# EAGLE design TSOC_Block_Template_Dual_SS_SMD (EAGLE 6.6.0)
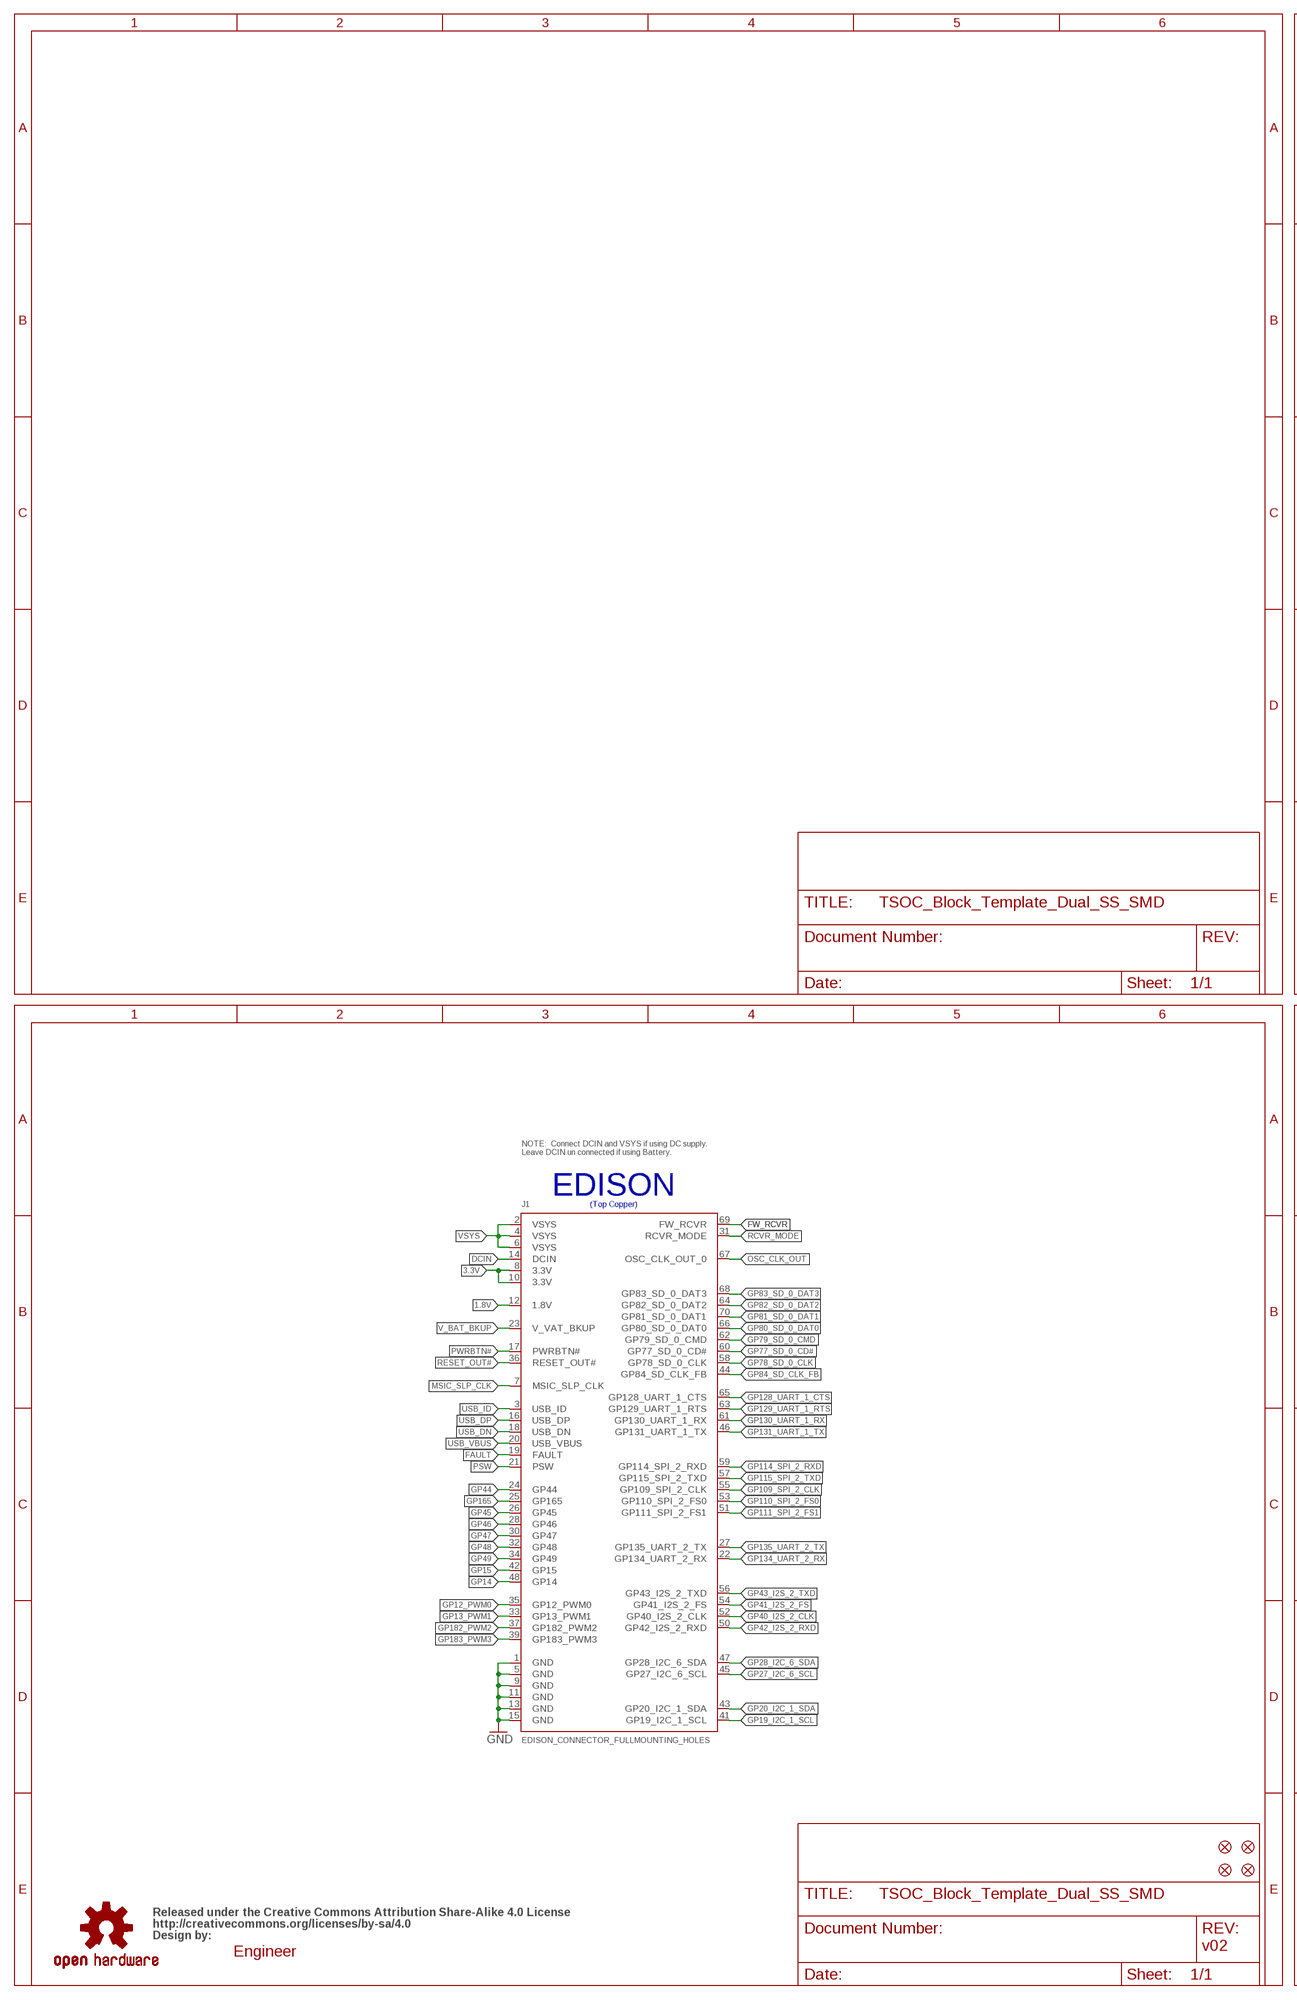
[diagram p0: schematic, sheet 1, part 1 of 2]
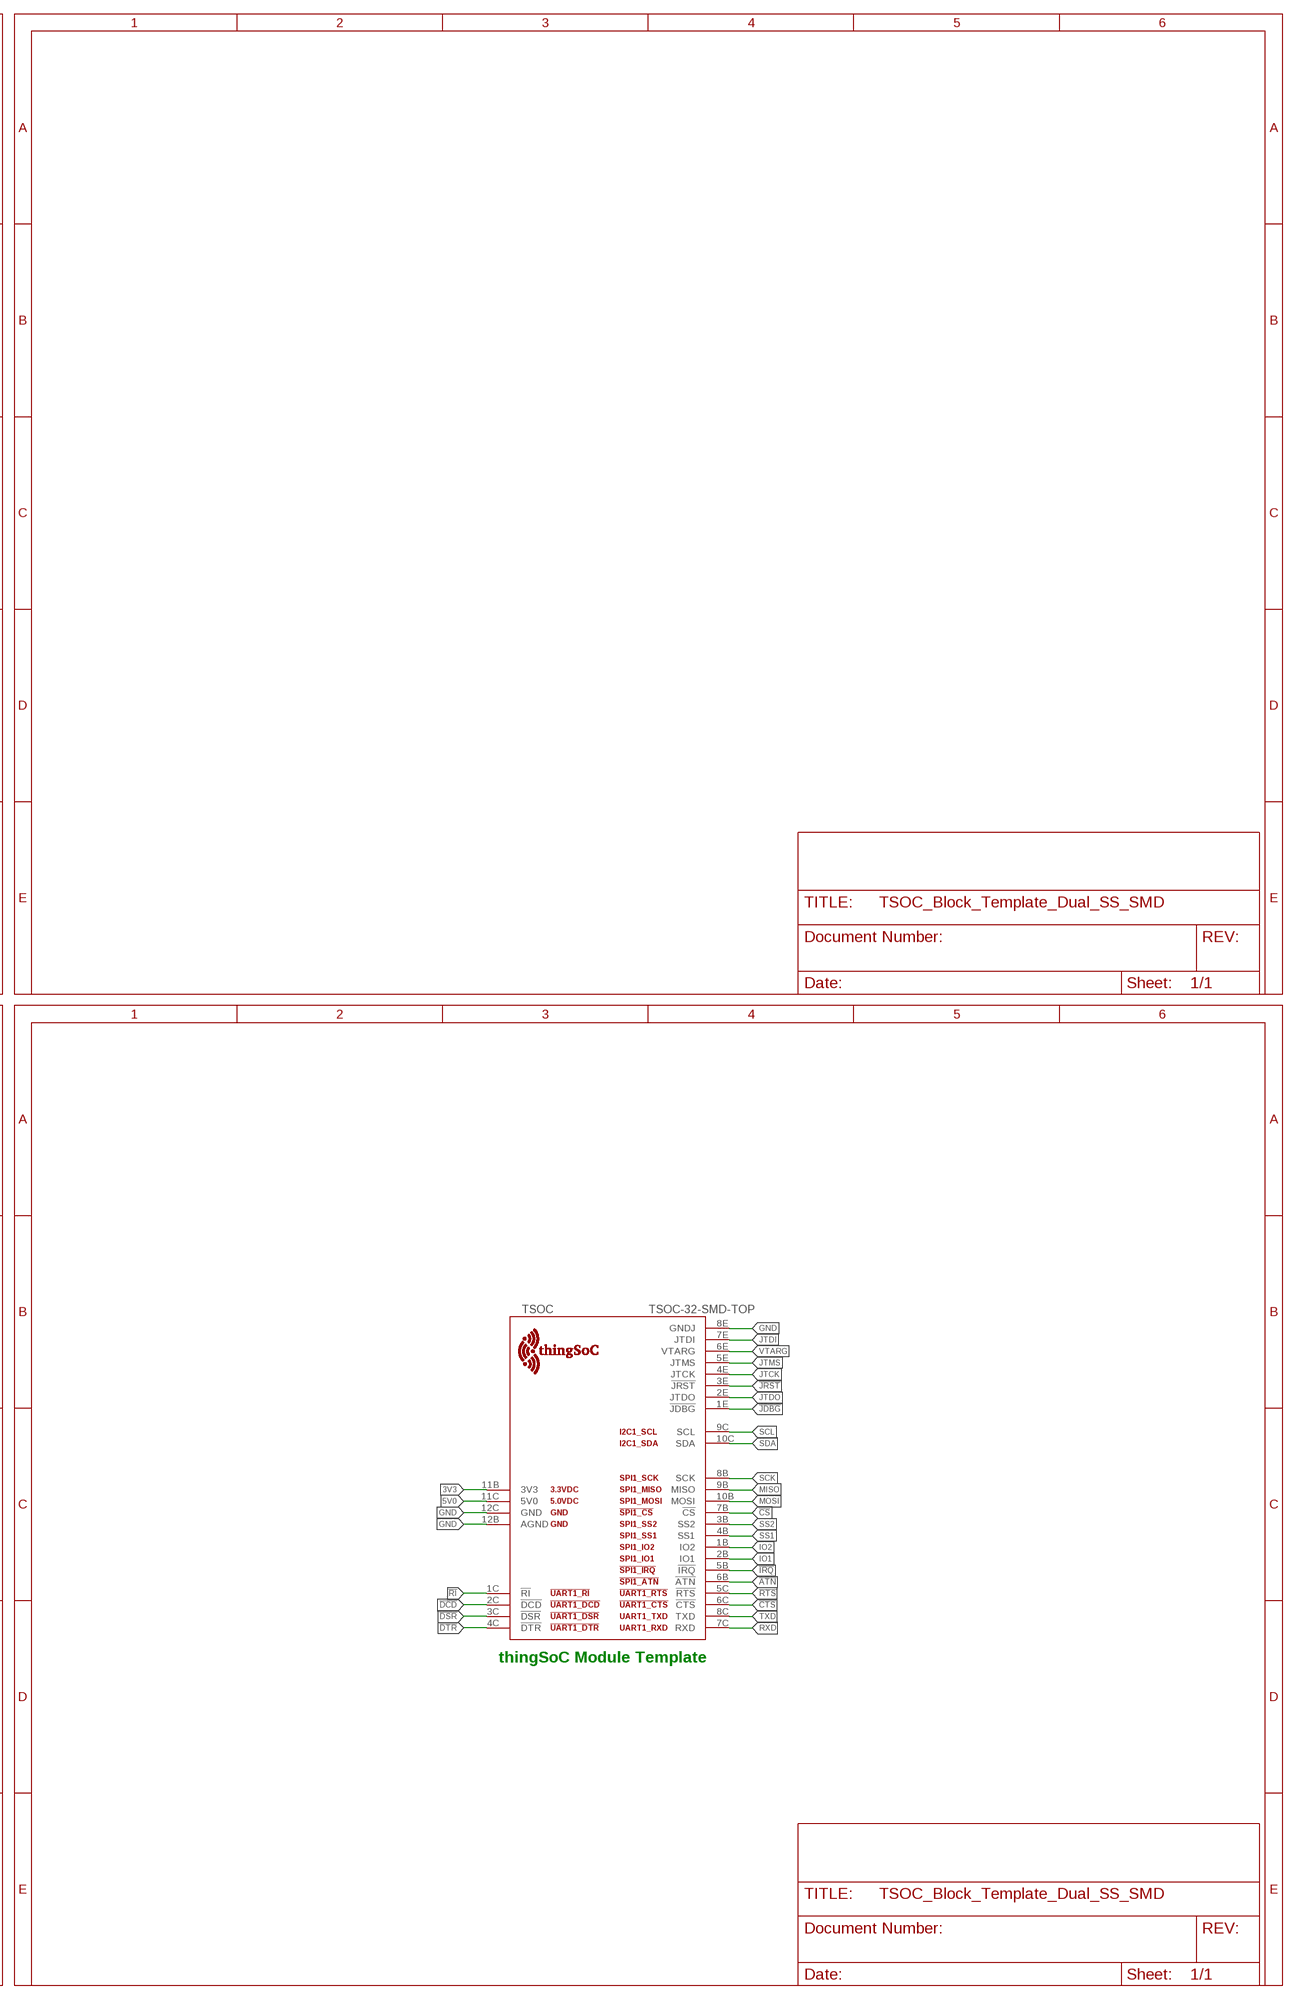
[diagram p1: schematic, sheet 1, part 2 of 2]

## Parts
FID5  FIDUCIAL1X2  [FIDUCIAL-1X2]
FID6  FIDUCIAL1X2  [FIDUCIAL-1X2]
FID7  FIDUCIAL1X2  [FIDUCIAL-1X2]
FID8  FIDUCIAL1X2  [FIDUCIAL-1X2]
J1  EDISON_CONNECTOR_FULLMOUNTING_HOLES  [EDISON_DAUGHTER]
LOGO5  OSHW-LOGOS  [OSHW-LOGO-S]
TSOC  TSOC-32-SMD-TOP  [TSOC-BB-S32-SMD-TOP]
U$1  BY_CC_SA_TEXTTEXT  [BY_CC_SA_TEXT]

## Nets
1.8V: J1.12(1.8V)
3.3V: J1.8(3.3V) J1.10(3.3V)
3V3: TSOC.11B(3V3)
5V0: TSOC.11C(5V0)
!ATN: TSOC.6B(!ATN)
!CS: TSOC.7B(!CS)
!CTS: TSOC.6C(!CTS)
!DCD: TSOC.2C(!DCD)
!DSR: TSOC.3C(!DSR)
!DTR: TSOC.4C(!DTR)
!IRQ: TSOC.5B(!IRQ)
!JDBG: TSOC.1E(!JDBG)
!JRST: TSOC.3E(!JRST)
!RI: TSOC.1C(!RI)
!RTS: TSOC.5C(!RTS)
DCIN: J1.14(DCIN)
FAULT: J1.19(FAULT)
FW_RCVR: J1.69(FW_RCVR)
GND: J1.1(GND) J1.5(GND) J1.9(GND) J1.11(GND) J1.13(GND) J1.15(GND) TSOC.8E(GNDJ) TSOC.12B(AGND) TSOC.12C(GND)
GP12_PWM0: J1.35(GP12_PWM0)
GP13_PWM1: J1.33(GP13_PWM1)
GP14: J1.48(GP14)
GP15: J1.42(GP15)
GP19_I2C_1_SCL: J1.41(GP19_I2C_1_SCL)
GP20_I2C_1_SDA: J1.43(GP20_I2C_1_SDA)
GP27_I2C_6_SCL: J1.45(GP27_I2C_6_SCL)
GP28_I2C_6_SDA: J1.47(GP28_I2C_6_SDA)
GP40_I2S_2_CLK: J1.52(GP40_I2S_2_CLK)
GP41_I2S_2_FS: J1.54(GP41_I2S_2_FS)
GP42_I2S_2_RXD: J1.50(GP42_I2S_2_RXD)
GP43_I2S_2_TXD: J1.56(GP43_I2S_2_TXD)
GP44: J1.24(GP44)
GP45: J1.26(GP45)
GP46: J1.28(GP46)
GP47: J1.30(GP47)
GP48: J1.32(GP48)
GP49: J1.34(GP49)
GP77_SD_0_CD#: J1.60(GP77_SD_0_CD#)
GP78_SD_0_CLK: J1.58(GP78_SD_0_CLK)
GP79_SD_0_CMD: J1.62(GP79_SD_0_CMD)
GP80_SD_0_DAT0: J1.66(GP80_SD_0_DAT0)
GP81_SD_0_DAT1: J1.70(GP81_SD_0_DAT1)
GP82_SD_0_DAT2: J1.64(GP82_SD_0_DAT2)
GP83_SD_0_DAT3: J1.68(GP83_SD_0_DAT3)
GP84_SD_CLK_FB: J1.44(GP84_SD_CLK_FB)
GP109_SPI_2_CLK: J1.55(GP109_SPI_2_CLK)
GP110_SPI_2_FS0: J1.53(GP110_SPI_2_FS0)
GP111_SPI_2_FS1: J1.51(GP111_SPI_2_FS1)
GP114_SPI_2_RXD: J1.59(GP114_SPI_2_RXD)
GP115_SPI_2_TXD: J1.57(GP115_SPI_2_TXD)
GP128_UART_1_CTS: J1.65(GP128_UART_1_CTS)
GP129_UART_1_RTS: J1.63(GP129_UART_1_RTS)
GP130_UART_1_RX: J1.61(GP130_UART_1_RX)
GP131_UART_1_TX: J1.46(GP131_UART_1_TX)
GP134_UART_2_RX: J1.22(GP134_UART_2_RX)
GP135_UART_2_TX: J1.27(GP135_UART_2_TX)
GP165: J1.25(GP165)
GP182_PWM2: J1.37(GP182_PWM2)
GP183_PWM3: J1.39(GP183_PWM3)
IO1: TSOC.2B(IO1)
IO2: TSOC.1B(IO2)
JTCK: TSOC.4E(JTCK)
JTDI: TSOC.7E(JTDI)
JTDO: TSOC.2E(JTDO)
JTMS: TSOC.5E(JTMS)
MISO: TSOC.9B(MISO)
MOSI: TSOC.10B(MOSI)
MSIC_SLP_CLK: J1.7(MSIC_SLP_CLK)
OSC_CLK_OUT: J1.67(OSC_CLK_OUT_0)
PSW: J1.21(PSW)
PWRBTN#: J1.17(PWRBTN#)
RCVR_MODE: J1.31(RCVR_MODE)
RESET_OUT#: J1.36(RESET_OUT#)
RXD: TSOC.7C(RXD)
SCK: TSOC.8B(SCK)
SCL: TSOC.9C(SCL)
SDA: TSOC.10C(SDA)
SS1: TSOC.4B(SS1)
SS2: TSOC.3B(SS2)
TXD: TSOC.8C(TXD)
USB_DN: J1.18(USB_DN)
USB_DP: J1.16(USB_DP)
USB_ID: J1.3(USB_ID)
USB_VBUS: J1.20(USB_VBUS)
V_BAT_BKUP: J1.23(V_VAT_BKUP)
VSYS: J1.2(VSYS) J1.4(VSYS) J1.6(VSYS)
VTARG: TSOC.6E(VTARG)

## Notes on the sheet
- NOTE:  Connect DCIN and VSYS if using DC supply.
  Leave DCIN un connected if using Battery.
- EDISON
- (Top Copper)
- thingSoC Module Template
- Engineer
- v02

## Library data of the parts
FID5-FID8 = SparkFun-Aesthetics:FIDUCIAL: Fiducial Alignment Points Various fiducial points for machine vision alignment.
J1 = Edison:EDISON_CONNECTOR_FULL
LOGO5 = SparkFun-Aesthetics:OSHW-LOGO: Open Source Hardware Logo This logo indicates the piece of hardware it is found on incorporates a OSHW license and/or adheres to the definition of open source hardware found here: http://freedomdefined.org/OSHW
TSOC = thingSoC:TSOC-32: thingSoC Thirty-Two (32) Pin Socket Source LBR : http://www.thingsoc.com Github : https://github.com/thingsoc License : http://creativecommons.org/licenses/by-sa/4.0/ (Creative Commons 4.0) THIS SOFTWARE IS PROVIDED BY THE CONTRIBUTORS "AS IS" AND WITHOUT ANY EXPRESS OR IMPLIED WARRANTIES, INCLUDING, BUT NOT LIMITED TO, THE IMPLIED WARRANTIES OF MERCHANTABILITY AND FITNESS FOR A PARTICULAR PURPOSE ARE DISCLAIMED. IN NO EVENT SHALL THE COPYRIGHT OWNER OR CONTRIBUTORS BE LIABLE FOR ANY DIRECT, INDIRECT, INCIDENTAL, SPECIAL, EXEMPLARY, OR CONSEQUENTIAL DAMAGES (INCLUDING, BUT NOT LIMITED TO, PROCUREMENT OF SUBSTITUTE GOODS OR SERVICES; LOSS OF USE, DATA, OR PROFITS; OR BUSINESS INTERRUPTION) HOWEVER CAUSED AND ON ANY THEORY OF LIABILITY, WHETHER IN CONTRACT, STRICT LIABILITY, OR TORT (INCLUDING NEGLIGENCE OR OTHERWISE) ARISING IN ANY WAY OUT OF THE USE OF THIS SOFTWARE, EVEN IF ADVISED OF THE POSSIBILITY OF SUCH DAMAGE.
U$1 = PatternAgents-Logos:BY_CC_SA_TEXT: BY_CC_SA_TEXT Source : http://wiki.creativecommons.org/CC_markers Github : https://github.com/PatternAgents/PCB_Libraries License : http://creativecommons.org/licenses/by-sa/4.0/ (Creative Commons 4.0) THIS SOFTWARE IS PROVIDED BY THE CONTRIBUTORS "AS IS" AND WITHOUT ANY EXPRESS OR IMPLIED WARRANTIES, INCLUDING, BUT NOT LIMITED TO, THE IMPLIED WARRANTIES OF MERCHANTABILITY AND FITNESS FOR A PARTICULAR PURPOSE ARE DISCLAIMED. IN NO EVENT SHALL THE COPYRIGHT OWNER OR CONTRIBUTORS BE LIABLE FOR ANY DIRECT, INDIRECT, INCIDENTAL, SPECIAL, EXEMPLARY, OR CONSEQUENTIAL DAMAGES (INCLUDING, BUT NOT LIMITED TO, PROCUREMENT OF SUBSTITUTE GOODS OR SERVICES; LOSS OF USE, DATA, OR PROFITS; OR BUSINESS INTERRUPTION) HOWEVER CAUSED AND ON ANY THEORY OF LIABILITY, WHETHER IN CONTRACT, STRICT LIABILITY, OR TORT (INCLUDING NEGLIGENCE OR OTHERWISE) ARISING IN ANY WAY OUT OF THE USE OF THIS SOFTWARE, EVEN IF ADVISED OF THE POSSIBILITY OF SUCH DAMAGE.

## Net classes
1 vcc: width 0.254 mm

## Board
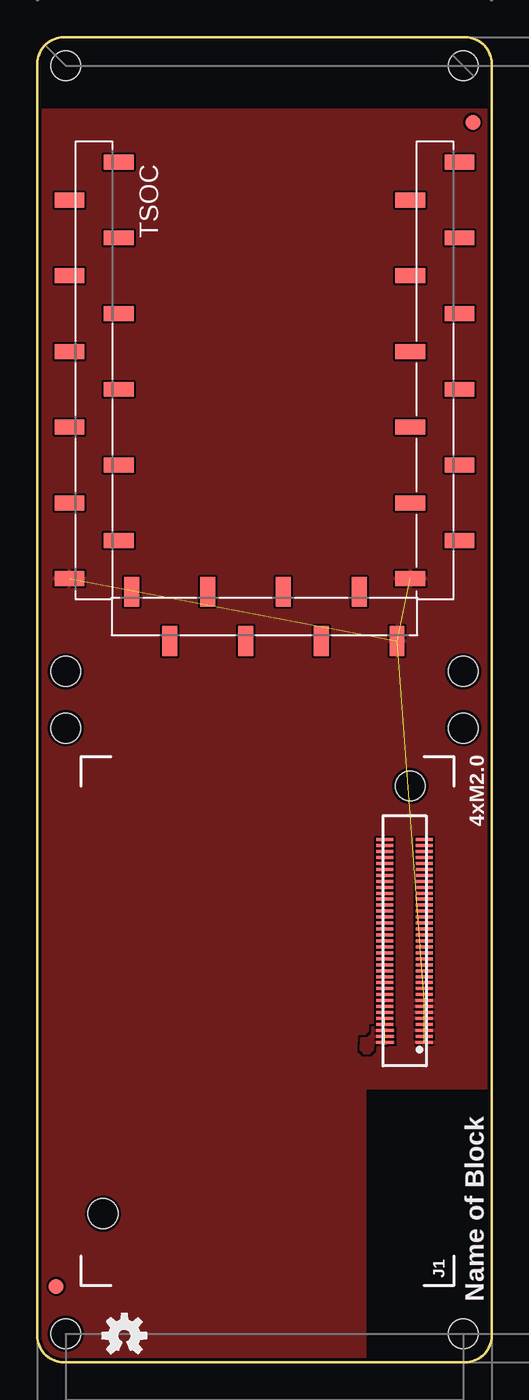
[diagram p2: board, top side]
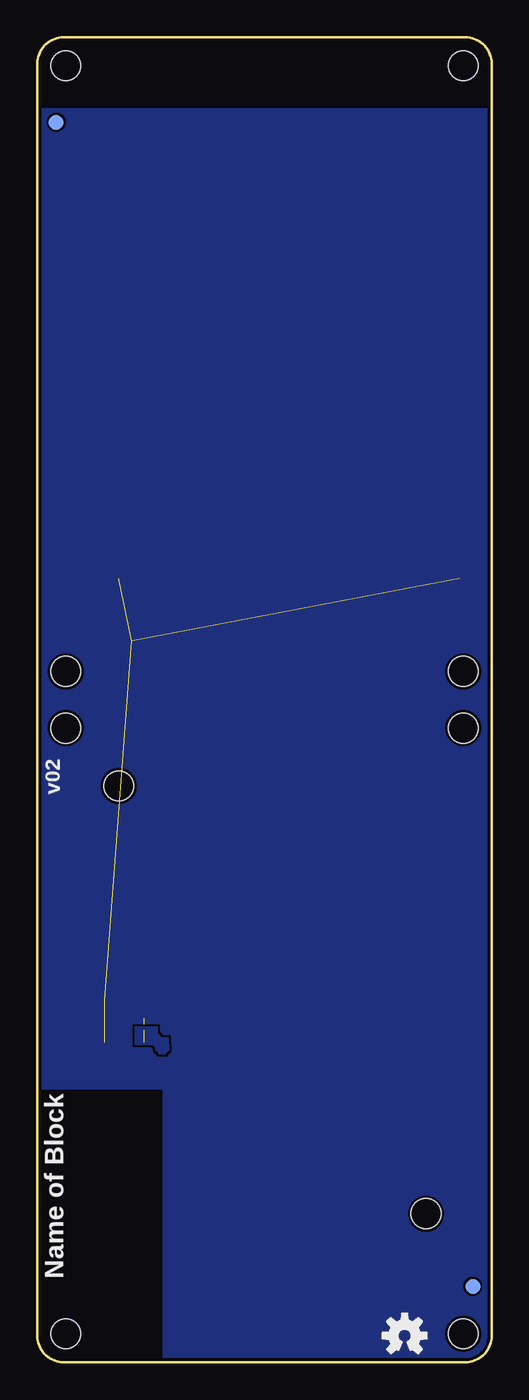
[diagram p3: board, bottom side, seen from below]

Size 30.48 x 88.9 mm. Coordinates in mm from the lower left corner, seen from the top.
Outline: 30.48,1.78 30.48,87.12 arc90 28.7,88.9 1.78,88.9 arc90 0,87.12 0,1.78 arc90 1.78,0 28.7,0 arc90 30.48,1.78
Copper layers (1*16): Top 0.035mm / dielectric 1.5mm / Bottom 0.035mm
Design rules "SparkFun-2-layer *": minimum track width 6mil, minimum drill 13mil, track to track 6mil, track to pad 6mil, pad to pad 6mil, via to via 6mil, smd to smd 6mil, copper to edge 8mil, drill to drill 8mil, minimum pad ring 12mil, minimum via ring 10mil, stop-mask expansion 4mil, vias tented up to drill 20mil, thermal gap 6mil
Holes 2 mm at 28.57,87 1.91,87 1.91,1.91 28.57,1.91 1.91,42.55 28.57,42.55 1.91,46.35 28.57,46.35
tRestrict: area 22.1,0 to 30.5,18.3; area 0,84.3 to 30.5,88.9
bRestrict: area 22.1,0 to 30.5,18.3; area 0,84.3 to 30.5,88.9

### Footprints (pad centres in the part's own frame; a part is rotated, then mirrored left to right if it is on the bottom)
FIDUCIAL-1X2 = smd 1 x 1: 1 0,0
EDISON_DAUGHTER = smd 1.14 x 0.2: 1 1.98,19.17; 2 4.62,19.17; 3 1.98,18.77; 4 4.62,18.77; 5 1.98,18.37; 6 4.62,18.37; 7 1.98,17.97; 8 4.62,17.97; 9 1.98,17.57; 10 4.62,17.57; 11 1.98,17.17; 12 4.62,17.17; 13 1.98,16.77; 14 4.62,16.77; 15 1.98,16.37; 16 4.62,16.37; 17 1.98,15.97; 18 4.62,15.97; 19 1.98,15.57; 20 4.62,15.57; 21 1.98,15.17; 22 4.62,15.17; 23 1.98,14.77; 24 4.62,14.77; 25 1.98,14.37; 26 4.62,14.37; 27 1.98,13.97; 28 4.62,13.97; 29 1.98,13.57; 30 4.62,13.57; 31 1.98,13.17; 32 4.62,13.17; 33 1.98,12.77; 34 4.62,12.77; 35 1.98,12.37; 36 4.62,12.37; 37 1.98,11.97; 38 4.62,11.97; 39 1.98,11.57; 40 4.62,11.57; 41 1.98,11.17; 42 4.62,11.17; 43 1.98,10.77; 44 4.62,10.77; 45 1.98,10.37; 46 4.62,10.37; 47 1.98,9.97; 48 4.62,9.97; 49 1.98,9.57; 50 4.62,9.57; 51 1.98,9.17; 52 4.62,9.17; 53 1.98,8.77; 54 4.62,8.77; 55 1.98,8.37; 56 4.62,8.37; 57 1.98,7.97; 58 4.62,7.97; 59 1.98,7.57; 60 4.62,7.57; 61 1.98,7.17; 62 4.62,7.17; 63 1.98,6.77; 64 4.62,6.77; 65 1.98,6.37; 66 4.62,6.37; 67 1.98,5.97; 68 4.62,5.97; 69 1.98,5.57; 70 4.62,5.57 | hole 2: 23.53,30.67; 2.93,1.98
TSOC-BB-S32-SMD-TOP = smd 1 x 2: 1B -11.43,-9.78; 1C -11.43,13.08; 2B -8.89,-13.08; 2C -8.89,9.78; 3B -6.35,-9.78; 3C -6.35,13.08; 4B -3.81,-13.08; 4C -3.81,9.78; 5B -1.27,-9.78; 5C -1.27,13.08; 6B 1.27,-13.08; 6C 1.27,9.78; 7B 3.81,-9.78; 7C 3.81,13.08; 8B 6.35,-13.08; 8C 6.35,9.78; 9B 8.89,-9.78; 9C 8.89,13.08; 10B 11.43,-13.08; 10C 11.43,9.78; 11B 13.97,-9.78; 11C 13.97,13.08; 12B 16.51,-13.08; 12C 16.51,9.78 | smd 2 x 1: 1E 17.4,-8.89; 2E 20.7,-6.35; 3E 17.4,-3.81; 4E 20.7,-1.27; 5E 17.4,1.27; 6E 20.7,3.81; 7E 17.4,6.35; 8E 20.7,8.89

### Placement (x,y rotation side)
FID5  1.27,5.08 0 bottom
FID6  1.27,5.08 0 top
FID7  29.21,83.19 0 bottom
FID8  29.21,83.19 0 top
J1  27.94,40.64 180 top
LOGO2  OSHW-LOGOS  [OSHW-LOGO-S]  5.84,1.78 0 top
LOGO5  5.84,1.78 0 bottom
TSOC  15.24,69.09 270 top
U$1  -11.94,-15.75 0 top  (outside the outline)

### Tracks (layer width: path | path; a pad name or v marks a point on that pad's centre or on a via)
3.3V  (1 unrouted)
GND  (8 unrouted)
  pour Top (rank 6): 30.48,1.78 30.48,87.12 arc90 28.7,88.9 1.78,88.9 arc90 0,87.12 0,1.78 arc90 1.78,0 28.7,0 arc90
  pour Bottom (rank 6): 30.48,87.12 arc90 28.75,88.9 1.78,88.9 arc90 0,87.12 0,1.78 arc90 1.78,0 28.7,0 arc90 30.48,1.78
VSYS  (2 unrouted)
  pour Top: 21.72,21.74 21.69,20.95 21.92,20.73 22.28,20.73 22.5,20.95 22.5,21.13 22.73,21.36 23.88,21.36 23.88,22.45 22.45,22.45 22.45,22.07 22.12,21.74
  pour Bottom: 21.72,21.74 21.69,20.95 21.92,20.73 22.28,20.73 22.5,20.95 22.5,21.13 22.73,21.36 23.88,21.36 23.88,22.45 22.45,22.45 22.45,22.07 22.12,21.74

### Text on the board
tPlace: 4xM2.0 | Name of Block
bPlace: v02 | Name of Block
tDocu: Max Board Length | User Interface/Connectors / RF/Antenna Safe Area | LEDs & User Switches/Buttons go here | Nothing goes here! / I mean it... | Note: Units are in Inches | Engineer